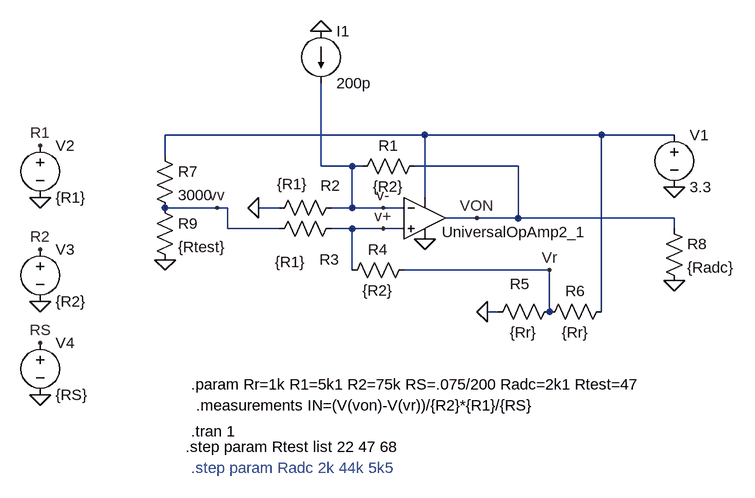
[diagram p0: schematic ib_filter_module_ladder.asc]
ib_filter_module_ladder.asc, the LTspice schematic file:
Version 4
SHEET 1 1480 704
WIRE 160 16 -240 16
WIRE 432 16 160 16
WIRE 544 16 432 16
WIRE -240 48 -240 16
WIRE 0 64 0 -64
WIRE 48 64 0 64
WIRE 64 64 48 64
WIRE 304 64 144 64
WIRE 160 112 160 16
WIRE -160 128 -240 128
WIRE -144 128 -160 128
WIRE -64 128 -96 128
WIRE 48 128 48 64
WIRE 48 128 16 128
WIRE 96 128 48 128
WIRE 128 128 96 128
WIRE 240 144 192 144
WIRE 304 144 304 64
WIRE 304 144 240 144
WIRE 544 144 304 144
WIRE -144 160 -144 128
WIRE -64 160 -144 160
WIRE 48 160 16 160
WIRE 96 160 48 160
WIRE 128 160 96 160
WIRE 544 160 544 144
WIRE 48 224 48 160
WIRE 352 224 128 224
WIRE 272 288 256 288
WIRE 352 288 352 224
WIRE 432 288 432 16
FLAG 160 176 0
FLAG 544 96 0
FLAG 256 288 0
FLAG 96 128 v-
FLAG 96 160 v+
FLAG 240 144 VON
FLAG 544 240 0
FLAG 352 224 Vr
FLAG -432 112 0
FLAG -432 272 0
FLAG -432 416 0
FLAG -432 32 R1
FLAG -432 192 R2
FLAG -432 336 RS
FLAG -240 208 0
FLAG -96 128 0
FLAG -160 128 vv
FLAG 0 -144 0
SYMBOL voltage 544 0 R0
WINDOW 123 0 0 Left 0
WINDOW 39 0 0 Left 0
SYMATTR InstName V1
SYMATTR Value 3.3
SYMBOL res 160 48 R90
WINDOW 0 0 56 VBottom 2
WINDOW 3 32 56 VTop 2
SYMATTR InstName R1
SYMATTR Value {R2}
SYMBOL res 32 112 R90
WINDOW 0 -3 17 VBottom 2
WINDOW 3 -36 76 VTop 2
SYMATTR InstName R2
SYMATTR Value {R1}
SYMBOL res 32 144 R90
WINDOW 0 79 19 VBottom 2
WINDOW 3 52 79 VTop 2
SYMATTR InstName R3
SYMATTR Value {R1}
SYMBOL res 144 208 R90
WINDOW 0 0 56 VBottom 2
WINDOW 3 32 56 VTop 2
SYMATTR InstName R4
SYMATTR Value {R2}
SYMBOL res 368 272 R90
WINDOW 0 -11 62 VBottom 2
WINDOW 3 32 56 VTop 2
SYMATTR InstName R5
SYMATTR Value {Rr}
SYMBOL res 448 272 R90
WINDOW 0 0 56 VBottom 2
WINDOW 3 32 56 VTop 2
SYMATTR InstName R6
SYMATTR Value {Rr}
SYMBOL res 528 144 R0
SYMATTR InstName R8
SYMATTR Value {Radc}
SYMBOL OpAmps\\UniversalOpamp2 160 144 R0
WINDOW 0 26 21 Left 2
SYMATTR InstName UniversalOpAmp2_1
SYMBOL voltage -432 16 R0
WINDOW 123 0 0 Left 0
WINDOW 39 0 0 Left 0
SYMATTR InstName V2
SYMATTR Value {R1}
SYMBOL voltage -432 176 R0
WINDOW 123 0 0 Left 0
WINDOW 39 0 0 Left 0
SYMATTR InstName V3
SYMATTR Value {R2}
SYMBOL voltage -432 320 R0
WINDOW 123 0 0 Left 0
WINDOW 39 0 0 Left 0
SYMATTR InstName V4
SYMATTR Value {RS}
SYMBOL res -256 32 R0
SYMATTR InstName R7
SYMATTR Value 3000
SYMBOL res -256 112 R0
SYMATTR InstName R9
SYMATTR Value {Rtest}
SYMBOL current 0 -144 R0
WINDOW 123 0 0 Left 0
WINDOW 39 0 0 Left 0
SYMATTR InstName I1
SYMATTR Value 200p
TEXT -200 400 Left 2 !.param Rr=1k R1=5k1 R2=75k RS=.075/200 Radc=2k1 Rtest=47
TEXT -200 472 Left 2 !.tran 1
TEXT -192 432 Left 2 !.measurements IN=(V(von)-V(vr))/{R2}*{R1}/{RS}
TEXT -208 496 Left 2 !.step param Rtest list 22 47 68
TEXT -200 528 Left 2 ;.step param Radc 2k 44k 5k5

The netlist it stands for:
* ib_filter_module_ladder.asc
V1 N001 0 3.3
R1 VON v- {R2}
R2 v- 0 {R1}
R3 v+ vv {R1}
R4 Vr v+ {R2}
R5 Vr 0 {Rr}
R6 N001 Vr {Rr}
R8 VON 0 {Radc}
XUniversalOpAmp2_1 v+ v- N001 0 VON level.2 Avol=1Meg GBW=10Meg Slew=10Meg ilimit=25m rail=0 Vos=0 phimargin=45 en=0 enk=0 in=0 ink=0 Rin=500Meg  ; pins IN+ IN- V+ V- OUT
V2 R1 0 {R1}
V3 R2 0 {R2}
V4 RS 0 {RS}
R7 N001 vv 3000
R9 vv 0 {Rtest}
I1 0 v- 200p
.param Rr=1k R1=5k1 R2=75k RS=.075/200 Radc=2k1 Rtest=47
.tran 1
.measurements IN=(V(von)-V(vr))/{R2}*{R1}/{RS}
.step param Rtest list 22 47 68
* .step param Radc 2k 44k 5k5
.lib UniversalOpamps2.sub
.backanno
.end